# EAGLE design ESP8266Tiny (EAGLE 7.1.0)
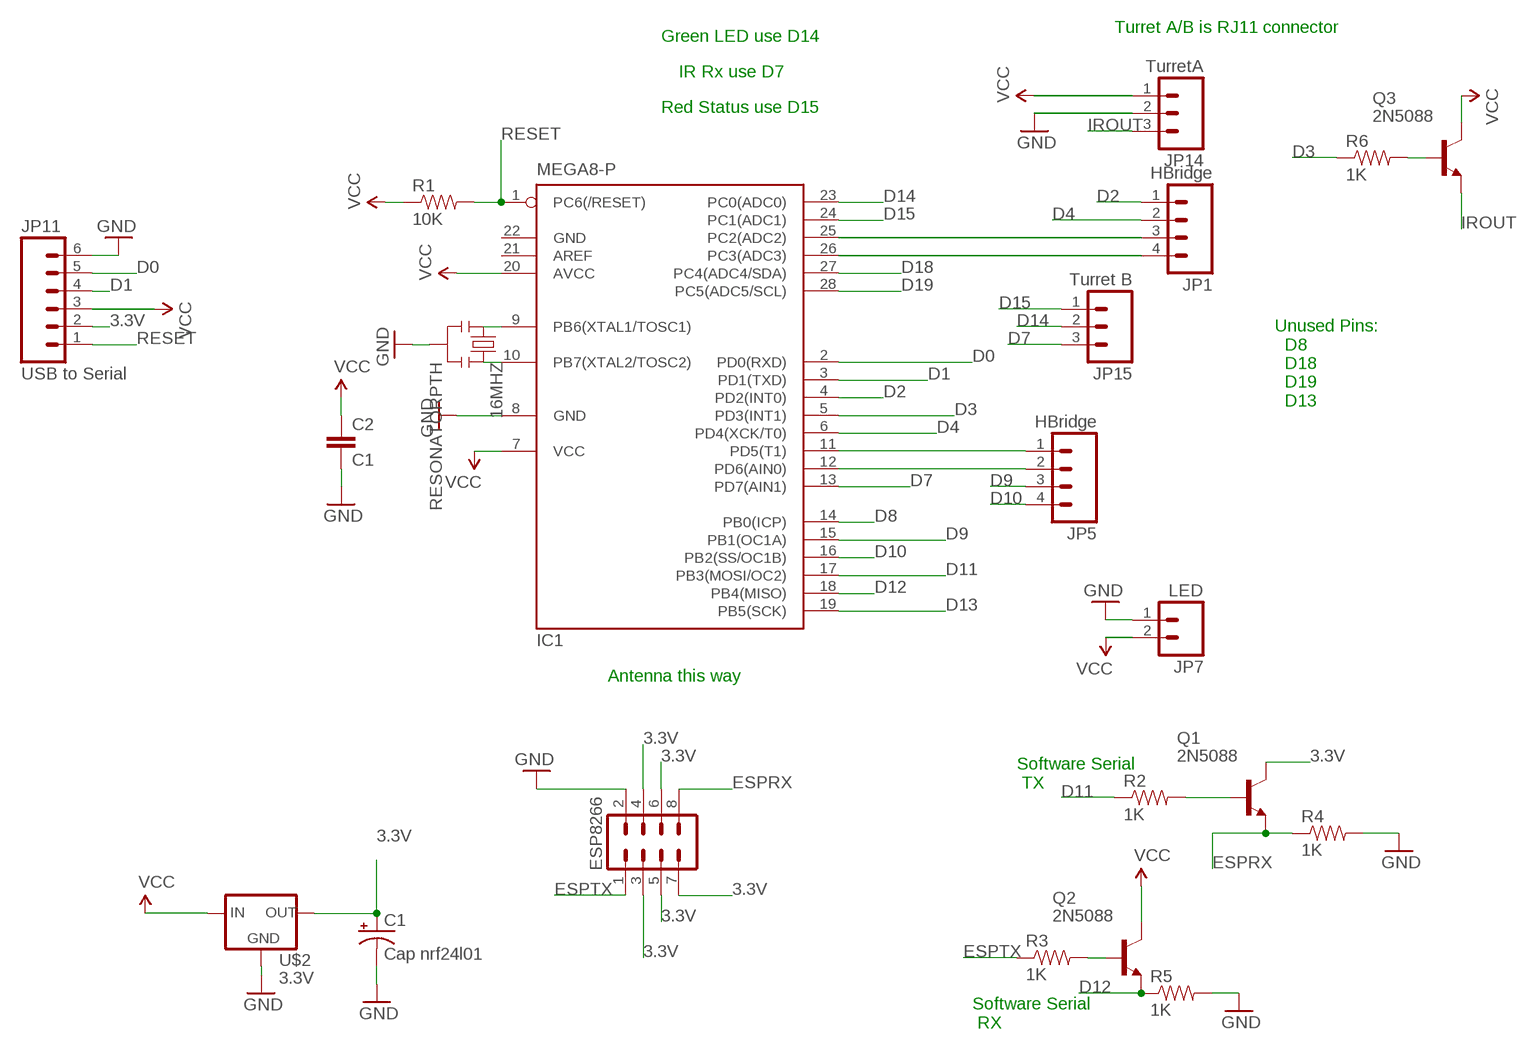
[diagram p0: schematic, sheet 1]

## Parts
16MHZ  RESONATORPTH  [RESONATOR-PTH]
C1  Cap nrf24l01  CAP_POLPTH2  [CPOL-RADIAL-10UF-25V]
C2  C1  CAPPTH  [CAP-PTH-SMALL]
ESP8266  M04X2  [2X4]
IC1  MEGA8-P  [DIL28-3]
JP1  HBridge  M04PTH  [1X04]
JP5  HBridge  M04PTH  [1X04]
JP7  LED  M02PTH  [1X02]
JP11  USB to Serial  M06SIP  [1X06]
JP14  TurretA  M03PTH  [1X03]
JP15  Turret B  M03PTH  [1X03]
Q1  2N5088  [TO92]
Q2  2N5088  [TO92]
Q3  2N5088  [TO92]
R1  10K  RESISTORPTH1  [AXIAL-0.3]
R2  1K  RESISTORPTH1  [AXIAL-0.3]
R3  1K  RESISTORPTH1  [AXIAL-0.3]
R4  1K  RESISTORPTH1  [AXIAL-0.3]
R5  1K  RESISTORPTH1  [AXIAL-0.3]
R6  1K  RESISTORPTH1  [AXIAL-0.3]
U$2  3.3V  V_REG_LD1117VXX  [78XXL]

## Nets
3.3V: C1.1(+) ESP8266.3 ESP8266.4 ESP8266.5 ESP8266.6 ESP8266.7 JP11.2 Q1.1(C) U$2.GND(OUT)
D0: IC1.2(PD0(RXD)) JP11.5
D1: IC1.3(PD1(TXD)) JP11.4
D2: IC1.4(PD2(INT0)) JP1.1
D3: IC1.5(PD3(INT1)) R6.P$1
D4: IC1.6(PD4(XCK/T0)) JP1.2
D7: IC1.13(PD7(AIN1)) JP15.3
D8: IC1.14(PB0(ICP))
D9: IC1.15(PB1(OC1A)) JP5.3
D10: IC1.16(PB2(SS/OC1B)) JP5.4
D11: IC1.17(PB3(MOSI/OC2)) R2.P$1
D12: IC1.18(PB4(MISO)) Q2.3(E) R5.P$1
D13: IC1.19(PB5(SCK))
D14: IC1.23(PC0(ADC0)) JP15.2
D15: IC1.24(PC1(ADC1)) JP15.1
D18: IC1.27(PC4(ADC4/SDA))
D19: IC1.28(PC5(ADC5/SCL))
ESPRX: ESP8266.8 Q1.3(E) R4.P$1
ESPTX: ESP8266.1 R3.P$1
GND: 16MHZ.2 C1.2(-) C2.2 ESP8266.2 IC1.8(GND) JP7.1 JP11.6 JP14.2 R4.P$2 R5.P$2 U$2.IN(GND)
IROUT: JP14.3 Q3.3(E)
N$1: 16MHZ.3 IC1.10(PB7(XTAL2/TOSC2))
N$2: 16MHZ.1 IC1.9(PB6(XTAL1/TOSC1))
N$3: Q1.2(B) R2.P$2
N$4: Q2.2(B) R3.P$2
N$5: Q3.2(B) R6.P$2
N$8: IC1.11(PD5(T1)) JP5.1
N$17: IC1.25(PC2(ADC2)) JP1.3
N$18: IC1.26(PC3(ADC3)) JP1.4
N$26: IC1.12(PD6(AIN0)) JP5.2
RESET: IC1.1(PC6(/RESET)) JP11.1 R1.P$2
VCC: C2.1 IC1.7(VCC) IC1.20(AVCC) JP7.2 JP11.3 JP14.1 Q2.1(C) Q3.1(C) R1.P$1 U$2.OUT(IN)
Unconnected: IC1.21(AREF)

## Notes on the sheet
- Turret A/B is RJ11 connector
- Green LED use D14
- IR Rx use D7
- Red Status use D15
- Unused Pins:
    D8
    D18
    D19
    D13
- Antenna this way
- Software Serial
   TX
- Software Serial
   RX

## Power pins joined to a net without a drawn wire
GND: IC1.22(GND)

## Library data of the parts
16MHZ = SparkFun:RESONATOR: Resonator Small SMD resonator. This is the itty bitty 10/20MHz resonators with built in caps. CSTCE10M0G55 and CSTCE20M0V53. Footprint has been reviewed closely but hasn't been tested yet.
C1 = SparkFun:CAP_POL: Capacitor Polarized These are standard SMD and PTH capacitors. Normally 10uF, 47uF, and 100uF in electrolytic and tantalum varieties. Always verify the external diameter of the through hole cap, it varies with capacity, voltage, and manufacturer. The EIA devices should be standard.
C2 = SparkFun:CAP: Capacitor Standard 0603 ceramic capacitor, and 0.1" leaded capacitor.
ESP8266 = SparkFun:M04X2
IC1 = atmel:MEGA8-P: MICROCONTROLLER 8 Kbytes FLASH, 1 kbytes SRAM, 512 bytes EEPROM, USART, 4-channel 10 bit ADC, 2-channel 8 bit ADC Pin compatible with Atmega48, ATMega88, ATMega168 Source: avr.lbr; OC_FARNELL: unknown; OC_NEWARK: unknown
JP1 JP5 = SparkFun:M04: Header 4 Standard 4-pin 0.1" header. Use with straight break away headers (SKU : PRT-00116), right angle break away headers (PRT-00553), swiss pins (PRT-00743), machine pins (PRT-00117), and female headers (PRT-00115). Molex polarized connector foot print use with SKU : PRT-08231 with associated crimp pins and housings.
JP7 = SparkFun:M02: Header 2 Standard 2-pin 0.1" header. Use with straight break away headers (SKU : PRT-00116), right angle break away headers (PRT-00553), swiss pins (PRT-00743), machine pins (PRT-00117), and female headers (PRT-00115). Molex polarized connector foot print use with SKU : PRT-08233 with associated crimp pins and housings.
JP11 = SparkFun:M06: Header 6 Standard 6-pin 0.1" header. Use with straight break away headers (SKU : PRT-00116), right angle break away headers (PRT-00553), swiss pins (PRT-00743), machine pins (PRT-00117), and female headers (PRT-00115). Molex polarized connector foot print use with SKU : PRT-08094 with associated crimp pins and housings. NOTES ON THE VARIANTS LOCK and LOCK_LONGPADS... This footprint was designed to help hold the alignment of a through-hole component (i.e. 6-pin header) while soldering it into place. You may notice that each hole has been shifted either up or down by 0.005 of an inch from it's more standard position (which is a perfectly straight line). This slight alteration caused the pins (the squares in the middle) to touch the edges of the holes. Because they are alternating, it causes a "brace" to hold the component in place. 0.005 has proven to be the perfect amount of "off-center" position when using our standard breakaway headers. Although looks a little odd when you look at the bare footprint, once you have a header in there, the alteration is very hard to notice. Also, if you push a header all the way into place, it is covered up entirely on the bottom side. This idea of altering the position of holes to aid alignment will be further integrated into the Sparkfun Library for other footprints. It can help hold any component with 3 or more connection pins.
JP14 JP15 = SparkFun:M03: Header 3 Standard 3-pin 0.1" header. Use with straight break away headers (SKU : PRT-00116), right angle break away headers (PRT-00553), swiss pins (PRT-00743), machine pins (PRT-00117), and female headers (PRT-00115). Molex polarized connector foot print use with SKU : PRT-08232 with associated crimp pins and housings.
Q1-Q3 = transistor-npn:2N5088: NPN Transistor
R1-R6 = SparkFun:RESISTOR: Resistor Basic schematic elements and footprints for 0603, 1206, and PTH 1/10th watt (small) resistors.
U$2 = SparkFun:V_REG_LD1117VXX: LD1117VXX voltage regulator. We carry the 3.3V version (COM-00526) in TO-220 package.

## Board
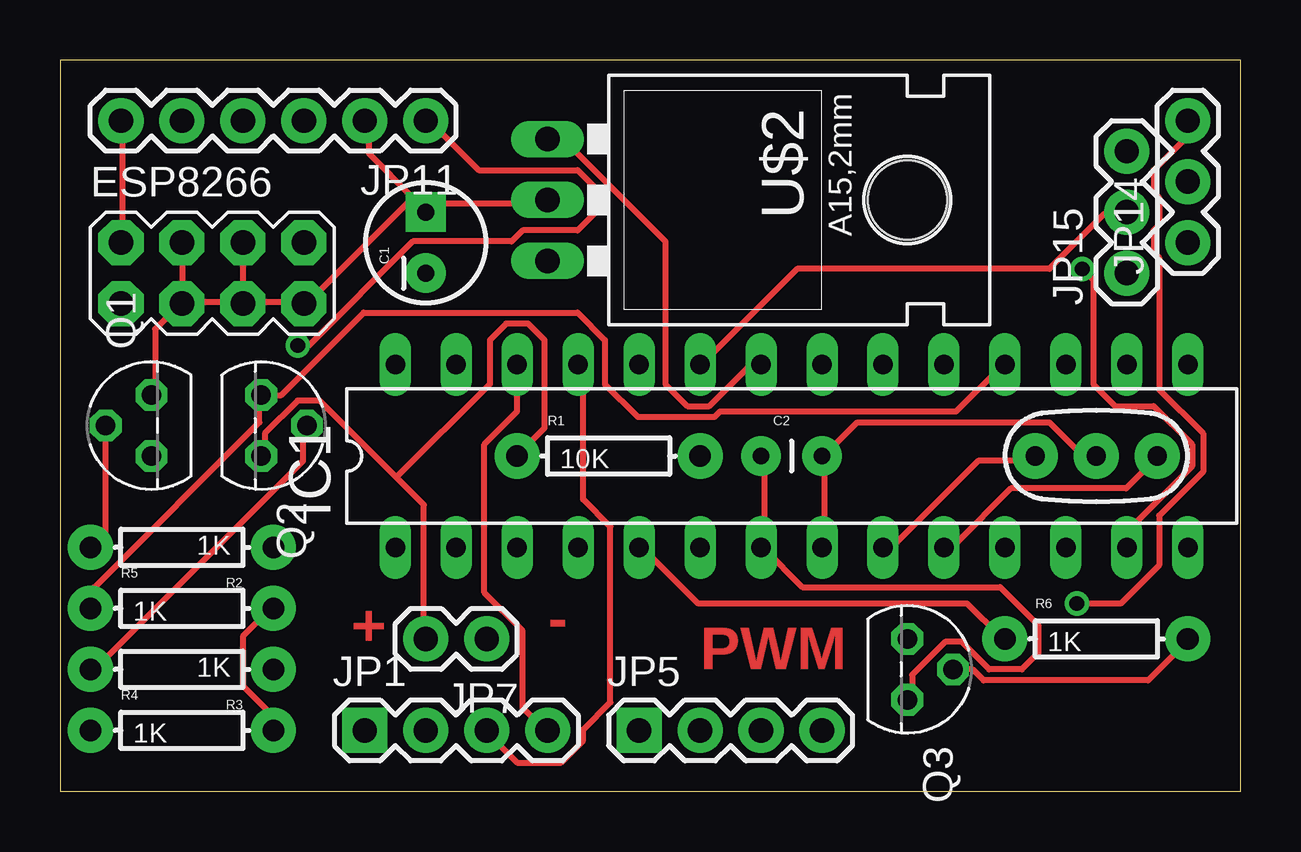
[diagram p1: board, top side]
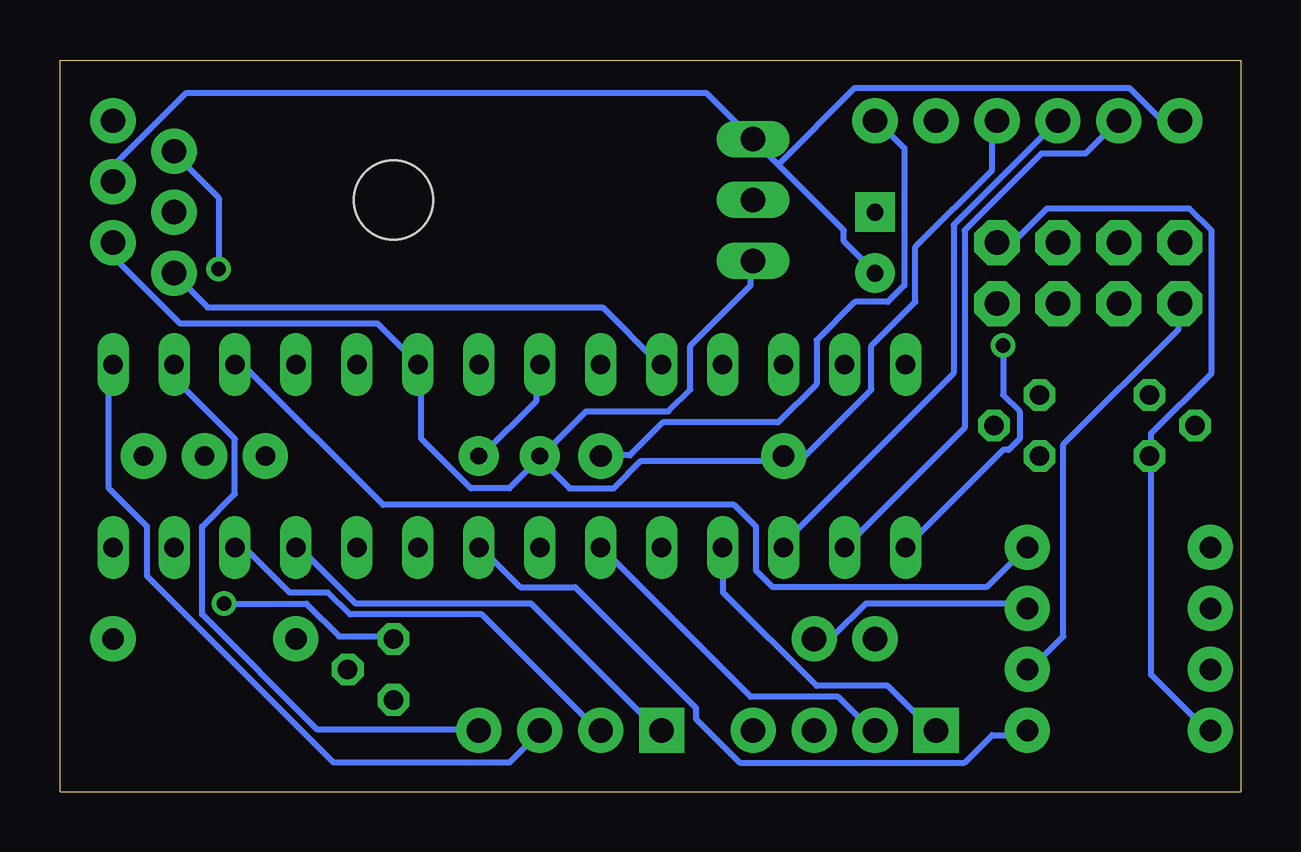
[diagram p2: board, bottom side, seen from below]

Size 49.2 x 30.48 mm. Coordinates in mm from the lower left corner, seen from the top.
Outline: 49.2,0 49.2,30.48 0,30.48 0,0 49.2,0
Copper layers (1*16): Top 0.035mm / dielectric 1.5mm / Bottom 0.035mm
Design rules "default": minimum track width 10mil, minimum drill 24mil, track to track 8mil, track to pad 8mil, pad to pad 8mil, via to via 8mil, smd to smd 8mil, copper to edge 40mil, drill to drill 8mil, minimum pad ring 10mil, minimum via ring 8mil, stop-mask expansion 4mil, vias tented up to drill 0mil, thermal gap 10mil

### Footprints (pad centres in the part's own frame; a part is rotated, then mirrored left to right if it is on the bottom)
RESONATOR-PTH = drill 0.8 pad 1.88: 1 -2.54,0; 2 0,0; 3 2.54,0
CPOL-RADIAL-10UF-25V = drill 0.7 pad 1.651 square: 1 1.27,0 | drill 0.7 pad 1.651: 2 -1.27,0
CAP-PTH-SMALL = drill 0.7 pad 1.651: 1 0,0; 2 2.54,0
2X4 = drill 1.016 pad 1.88 octagon: 1 -3.81,-1.27; 2 -3.81,1.27; 3 -1.27,-1.27; 4 -1.27,1.27; 5 1.27,-1.27; 6 1.27,1.27; 7 3.81,-1.27; 8 3.81,1.27
DIL28-3 = drill 0.813 long: 1 -16.51,-3.81; 2 -13.97,-3.81; 3 -11.43,-3.81; 4 -8.89,-3.81; 5 -6.35,-3.81; 6 -3.81,-3.81; 7 -1.27,-3.81; 8 1.27,-3.81; 9 3.81,-3.81; 10 6.35,-3.81; 11 8.89,-3.81; 12 11.43,-3.81; 13 13.97,-3.81; 14 16.51,-3.81; 15 16.51,3.81; 16 13.97,3.81; 17 11.43,3.81; 18 8.89,3.81; 19 6.35,3.81; 20 3.81,3.81; 21 1.27,3.81; 22 -1.27,3.81; 23 -3.81,3.81; 24 -6.35,3.81; 25 -8.89,3.81; 26 -11.43,3.81; 27 -13.97,3.81; 28 -16.51,3.81
1X04 = drill 1.016 pad 1.88 square: 1 0,0 | drill 1.016 pad 1.88: 2 2.54,0; 3 5.08,0; 4 7.62,0
1X02 = drill 1.016 pad 1.88: 1 0,0; 2 2.54,0
1X06 = drill 1.016 pad 1.88: 1 0,0; 2 2.54,0; 3 5.08,0; 4 7.62,0; 5 10.16,0; 6 12.7,0
1X03 = drill 1.016 pad 1.88: 1 0,0; 2 2.54,0; 3 5.08,0
TO92 = drill 0.813 octagon: 1 1.27,0; 2 0,1.905; 3 -1.27,0
AXIAL-0.3 = drill 0.9 pad 1.88: P$1 -3.81,0; P$2 3.81,0
78XXL = drill 1.016 long: GND 0,-3.81; IN -2.54,-3.81; OUT 2.54,-3.81 | hole 3.302: 0,11.176

### Placement (x,y rotation side)
16MHZ  43.18,13.98 0 top
C1  15.24,22.87 90 top
C2  29.21,13.98 0 top
ESP8266  6.35,21.6 0 top
IC1  30.48,13.98 0 top
JP1  12.7,2.55 0 top
JP5  24.13,2.55 0 top
JP7  17.78,6.36 180 top
JP11  15.24,27.95 180 top
JP14  46.99,22.87 90 top
JP15  44.45,21.6 90 top
Q1  3.81,15.25 90 top
Q2  8.38,15.25 270 top
Q3  35.31,5.09 270 top
R1  22.86,13.98 0 top
R2  5.08,10.17 180 top
R3  5.08,5.09 180 top
R4  5.08,2.55 0 top
R5  5.08,7.63 0 top
R6  43.18,6.36 0 top
U$2  24.13,24.65 270 top

### Tracks (layer width: path | path; a pad name or v marks a point on that pad's centre or on a via)
3.3V
  Top 0.254: C1.1 15.62,24.52 20.19,24.52 U$2.GND | 14.71,24.75 15.16,24.29 C1.1 | 14.71,24.75 12.88,26.58 12.88,27.95 JP11.2 | ESP8266.6 7.62,20.41 | 7.62,20.41 10.13,20.41 ESP8266.7 10.36,20.41 14.71,24.75 | Q1.1 3.96,16.52 3.96,19.26 4.88,20.18 ESP8266.3 5.1,20.41 | 5.1,20.41 5.1,22.69 ESP8266.4 | 5.1,20.41 7.62,20.41 | 7.62,20.41 ESP8266.5 | 14.71,24.75 C1.1
D0
  Bottom 0.254: IC1.2 16.31,10.35 11.51,15.15 11.51,23.38 8.31,26.58 6.48,26.58 5.1,27.95 JP11.5
D1
  Bottom 0.254: JP11.4 11.96,23.61 11.96,17.43 19.05,10.35 IC1.3
D2
  Bottom 0.254: IC1.4 21.56,10.12 21.56,8.29 17.68,4.4 14.71,4.4 12.88,2.57 JP1.1
D3
  Top 0.254: IC1.5 24.31,10.12 26.59,7.83 37.8,7.83 39.17,6.46 R6.P$1
D4
  Bottom 0.254: IC1.6 26.59,10.12 20.42,3.95 16.76,3.95 15.39,2.57 JP1.2
D7  (via drill 0.61)
  Top 0.254: v42.6,21.78 43.05,21.32 43.05,16.98 43.97,16.06 45.57,16.06 47.17,14.46 47.17,13.55 44.65,11.03 44.65,10.35 IC1.13
  Bottom 0.254: v42.6,21.78 42.6,24.75 44.42,26.58 JP15.3
D9
  Bottom 0.254: IC1.15 47.17,17.66 47.17,12.63 45.57,11.03 45.57,8.98 37.8,1.2 30.48,1.2 29.34,2.35 JP5.3
D10
  Bottom 0.254: IC1.16 44.42,17.66 44.42,17.21 41.91,14.69 41.91,12.41 43.28,11.03 43.28,7.38 38.48,2.57 31.85,2.57 JP5.4
D11
  Bottom 0.254: IC1.17 41.91,17.66 41.45,17.66 35.74,11.95 21.11,11.95 20.19,11.03 20.19,9.21 19.51,8.52 10.59,8.52 8.99,10.12 R2.P$1
D12
  Top 0.254: R5.P$1 1.45,7.83 1.45,8.52 8.31,15.38 8.31,16.52 Q2.3 9.22,16.52 12.65,19.95 21.56,19.95 22.71,18.81 22.71,16.98 24.08,15.61 27.28,15.61 27.51,15.83 37.34,15.83 39.17,17.66 IC1.18
D14
  Top 0.254: IC1.23 26.82,17.89 30.71,21.78 41.22,21.78 43.51,24.06 44.42,24.06 JP15.2
D15
  Bottom 0.254: IC1.24 24.31,17.89 26.59,20.18 43.05,20.18 44.42,21.55 JP15.1
ESPRX
  Bottom 0.254: R4.P$1 1.45,2.57 3.73,4.86 3.73,13.78 Q1.3 3.73,14 3.73,14.92 1.22,17.43 1.22,23.38 2.13,24.29 8.08,24.29 9.45,22.92 10.13,22.92 ESP8266.8
ESPTX
  Bottom 0.254: ESP8266.1 2.59,20.18 2.59,19.26 7.39,14.46 7.39,6.46 8.76,5.09 R3.P$1
GND
  Top 0.254: R4.P$2 8.76,2.57 8.76,3.26 7.62,4.4 7.62,6.46 8.76,7.61 R5.P$2 | IC1.8 31.85,10.35 31.85,13.78 C2.2 31.85,14 33.22,15.38 41.22,15.38 42.6,14 43.05,14 16MHZ.2 | ESP8266.2 2.59,22.92 2.59,27.95 JP11.6 | IC1.22 29.11,17.66 28.65,17.66 27.05,16.06 26.14,16.06 25.22,16.98 25.22,22.92 21.11,27.04 20.42,27.04 U$2.IN
  Bottom 0.254: JP7.1 17.68,6.46 16.99,6.46 15.62,7.83 8.99,7.83 R5.P$2 | IC1.22 29.34,17.66 29.34,16.29 31.62,14 C2.2 | R4.P$2 8.99,2.35 10.36,2.35 11.51,1.2 20.88,1.2 22.71,3.03 22.71,3.49 27.74,8.52 30.02,8.52 31.62,10.12 IC1.8 | 19.28,26.12 16.53,23.38 16.53,22.92 15.39,21.78 C1.2 | 19.28,26.12 20.19,27.04 U$2.IN 20.42,27.26 22.25,29.09 43.97,29.09 46.94,26.12 46.94,25.43 JP14.2 | JP11.6 3.28,27.95 4.65,29.32 16.08,29.32 19.28,26.12
IROUT  (via drill 0.61)
  Top 0.254: v42.37,7.83 44.2,7.83 45.8,9.43 45.8,11.49 47.62,13.32 47.62,14.92 45.8,16.75 45.8,22.24 45.57,22.46 45.57,23.38 45.8,23.61 45.8,24.75 45.57,24.98 45.57,25.89 46.94,27.26 46.94,27.95 JP14.3
  Bottom 0.254: v42.37,7.83 38.94,7.83 37.57,6.46 35.51,6.46 Q3.3
N$1
  Top 0.254: IC1.10 36.88,10.35 37.34,10.35 39.62,12.63 44.42,12.63 45.57,13.78 16MHZ.3
N$2
  Top 0.254: IC1.9 34.37,10.35 34.82,10.35 38.25,13.78 40.54,13.78 16MHZ.1
N$3
  Top 0.254: Q1.2 1.9,10.8 R2.P$2
N$4
  Top 0.254: Q2.2 10.13,15.15 10.13,13.78 1.45,5.09 R3.P$2
N$5
  Top 0.254: Q3.2 38.02,5.09 38.48,4.63 45.34,4.63 46.94,6.23 R6.P$2
N$8
  Bottom 0.254: IC1.11 39.17,10.12 36.88,7.83 29.57,7.83 24.31,2.57 JP5.1
N$17
  Top 0.254: IC1.25 21.79,17.66 21.79,12.18 22.94,11.03 22.94,3.72 21.79,2.57 21.79,2.12 20.88,1.2 19.05,1.2 17.91,2.35 JP1.3
N$18
  Top 0.254: IC1.26 19.05,15.83 17.68,14.46 17.68,8.29 19.28,6.69 19.28,3.49 20.19,2.57 JP1.4
N$26
  Bottom 0.254: IC1.12 41.91,10.12 41.45,10.12 39.62,8.29 38.02,8.29 37.11,7.38 31.62,7.38 26.82,2.57 JP5.2
RESET  (via drill 0.61)
  Top 0.254: v9.91,18.58 10.36,18.58 14.71,22.92 18.82,22.92 19.28,23.38 21.56,23.38 22.25,24.06 22.25,25.21 21.56,25.89 17.45,25.89 15.39,27.95 JP11.1
  Bottom 0.254: IC1.1 9.91,14.23 9.68,14.23 9.22,14.69 9.22,15.83 9.91,16.52 v9.91,18.58 | R1.P$2 26.59,14 25.45,14 24.08,15.38 19.28,15.38 17.68,16.98 17.68,18.81 16.08,20.41 14.71,20.41 14.02,21.09 14.02,26.81 15.16,27.95 JP11.1
VCC
  Top 0.254: 14.02,13.09 15.16,11.95 15.16,6.46 JP7.2 | 14.02,13.09 10.82,16.29 9.91,16.29 8.53,14.92 8.53,14 Q2.1 | C2.1 29.34,13.78 29.34,10.35 IC1.7 29.34,10.12 30.94,8.52 39.17,8.52 40.77,6.92 40.77,5.78 40.08,5.09 38.71,5.09 37.57,6.23 36.88,6.23 35.51,4.86 35.51,3.95 Q3.1 | 14.02,13.09 17.91,16.98 17.91,18.81 18.59,19.49 19.51,19.49 20.19,18.81 20.19,15.15 19.05,14 R1.P$1
  Bottom 0.254: C2.1 29.34,13.78 30.48,12.63 32.08,12.63 34.14,14.69 34.14,17.66 IC1.20 34.37,17.89 35.97,19.49 44.2,19.49 46.94,22.24 46.94,22.69 JP14.1 | U$2.OUT 20.42,22.01 20.42,21.09 22.94,18.58 22.94,16.75 23.85,15.83 27.28,15.83 29.11,14 C2.1 | C2.1 29.11,13.78 27.96,12.63 26.14,12.63 24.99,13.78 19.05,13.78 R1.P$1 19.05,14 18.14,14 15.39,16.75 15.39,18.58 13.56,20.41 13.56,22.69 10.36,25.89 10.36,27.95 JP11.3

### Text on the board
Top: + | - | PWM